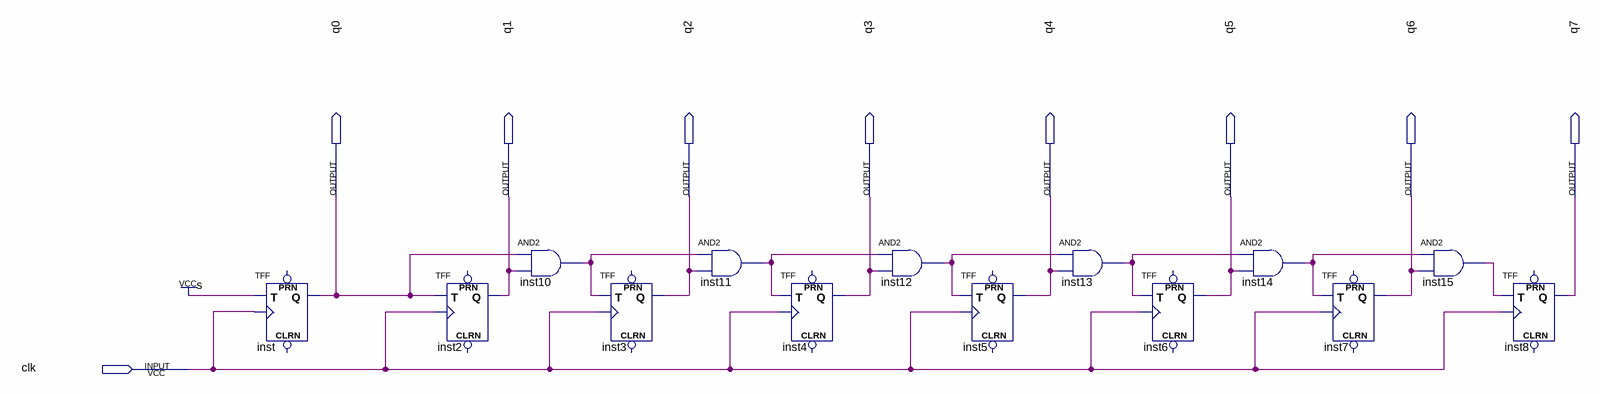
[diagram p0: schematic sheet]
// Quartus schematic Contador.bdf as structural Verilog: 14 symbols, 9 pins
module Contador (
  input  clk,
  output q0,
  output q1,
  output q2,
  output q3,
  output q4,
  output q5,
  output q6,
  output q7
);

  wire inst10_out, inst11_out, inst12_out, inst13_out, inst14_out, inst15_out;

  TFF inst (.T(1'b1), .CLK(clk), .Q(q0));  // open: PRN, CLRN
  TFF inst2 (.T(q0), .CLK(clk), .Q(q1));  // open: PRN, CLRN
  and inst10 (inst10_out, q0, q1);
  TFF inst3 (.T(inst10_out), .CLK(clk), .Q(q2));  // open: PRN, CLRN
  and inst11 (inst11_out, inst10_out, q2);
  TFF inst4 (.T(inst11_out), .CLK(clk), .Q(q3));  // open: PRN, CLRN
  and inst12 (inst12_out, inst11_out, q3);
  TFF inst5 (.T(inst12_out), .CLK(clk), .Q(q4));  // open: PRN, CLRN
  and inst13 (inst13_out, inst12_out, q4);
  TFF inst6 (.T(inst13_out), .CLK(clk), .Q(q5));  // open: PRN, CLRN
  and inst14 (inst14_out, inst13_out, q5);
  TFF inst7 (.T(inst14_out), .CLK(clk), .Q(q6));  // open: PRN, CLRN
  and inst15 (inst15_out, inst14_out, q6);
  TFF inst8 (.T(inst15_out), .CLK(clk), .Q(q7));  // open: PRN, CLRN
endmodule
